# EAGLE design doughduino-v1 (EAGLE 5.11)
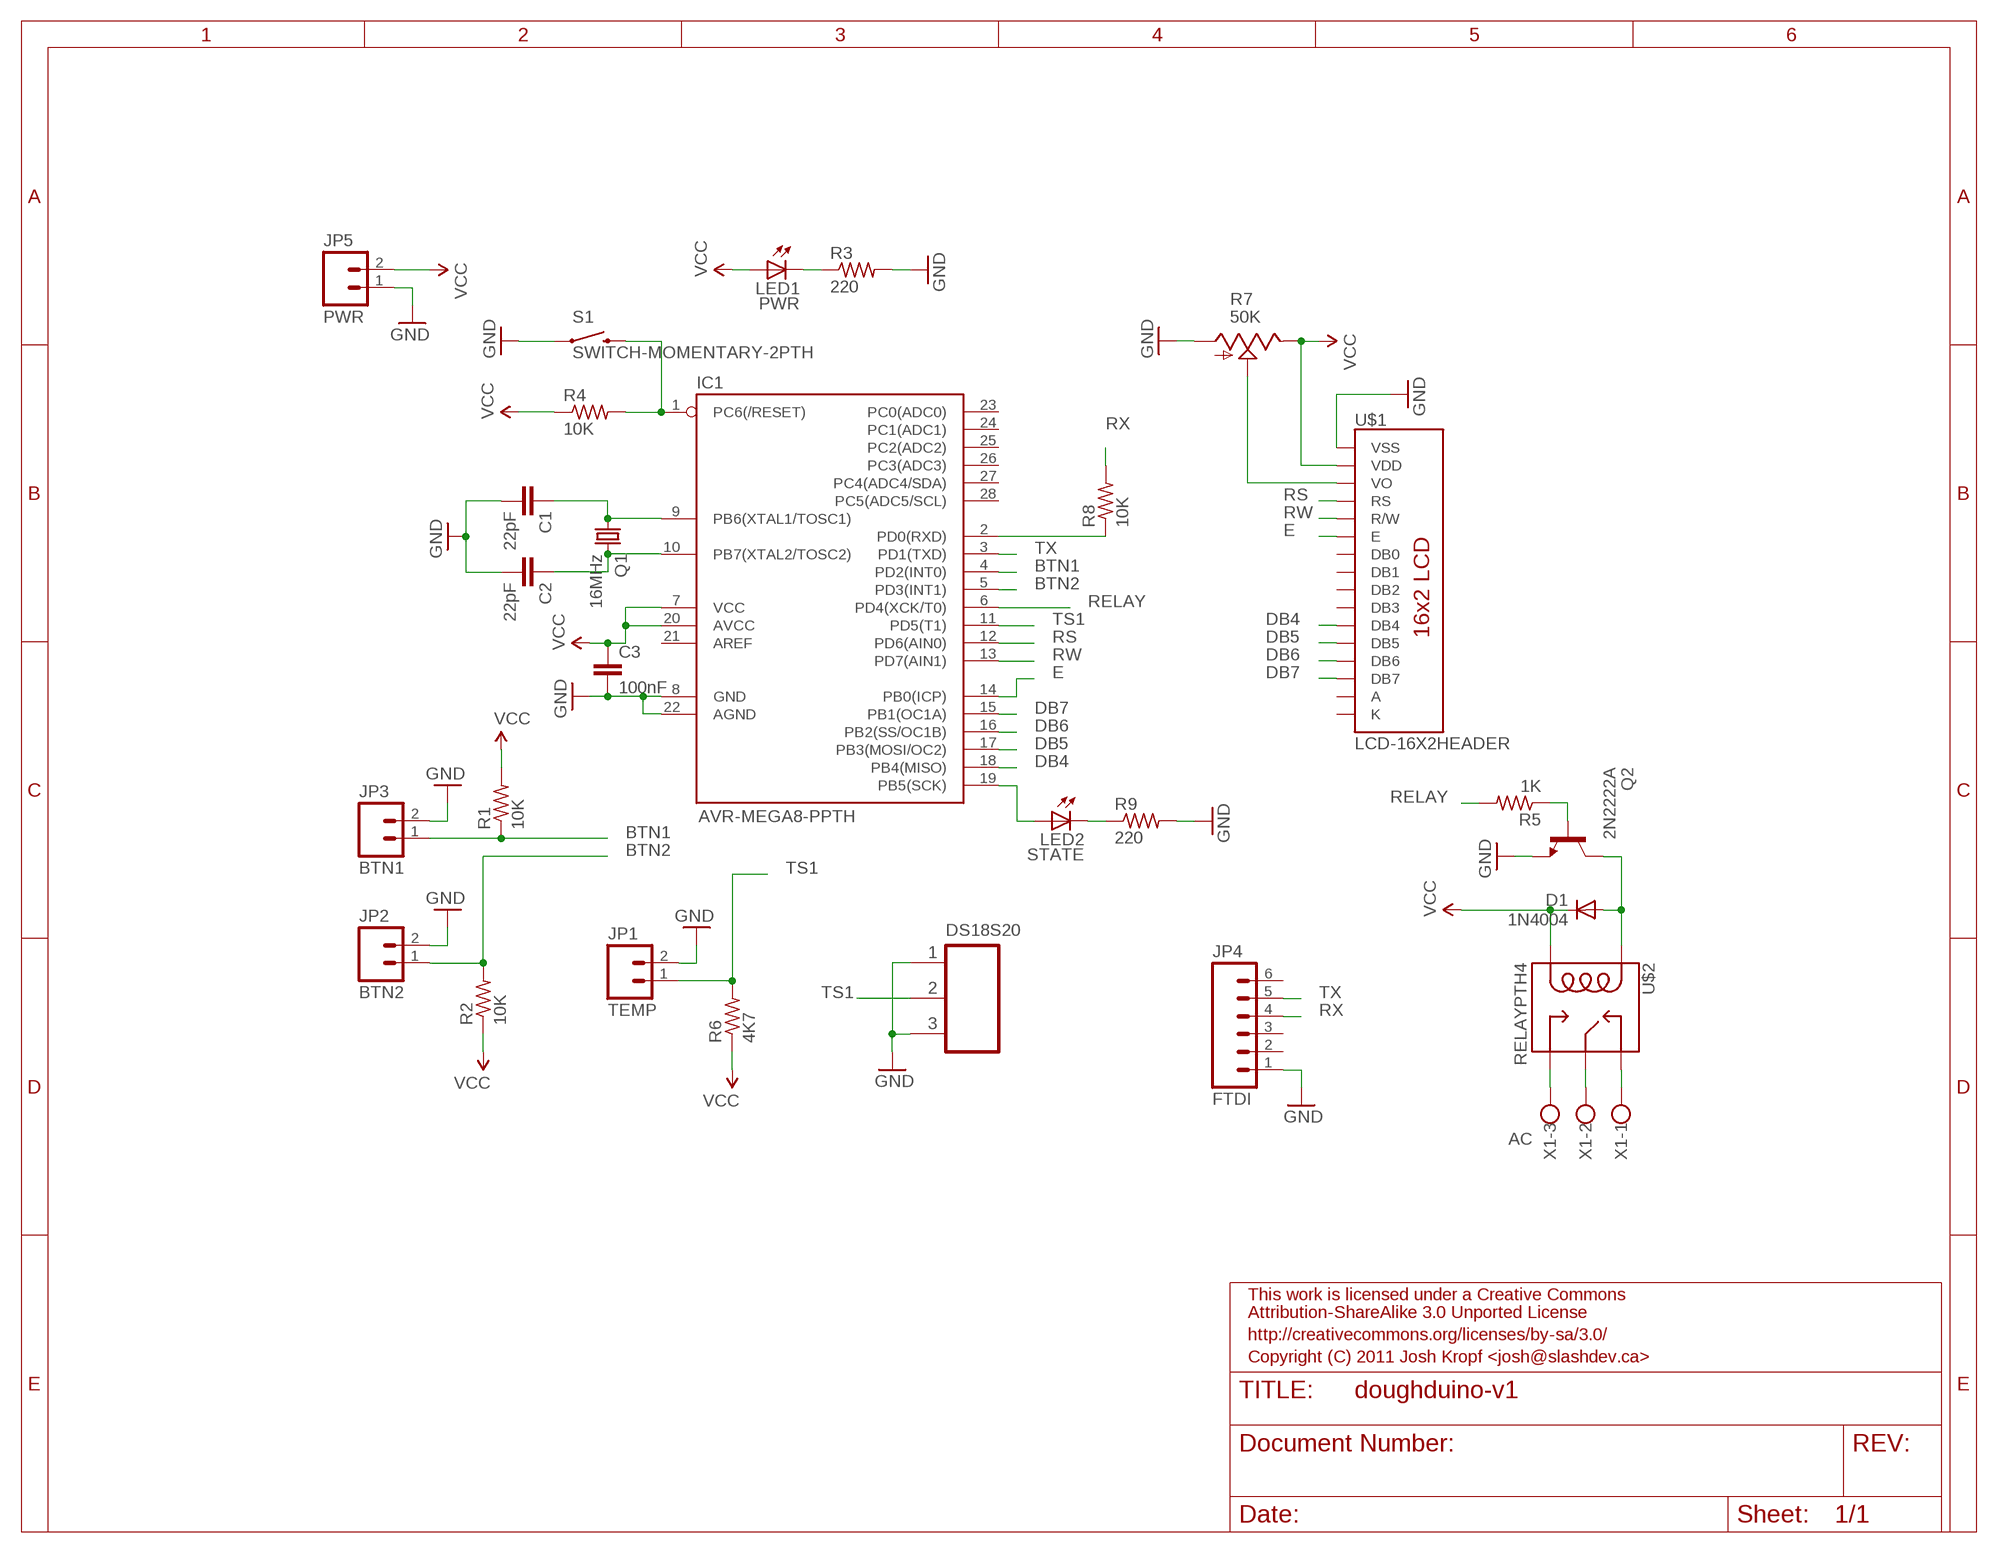
[diagram p0: schematic, sheet 1]

## Parts
C1  22pF  CAPPTH  [CAP-PTH-SMALL]
C2  22pF  CAPPTH  [CAP-PTH-SMALL]
C3  100nF  CAPPTH  [CAP-PTH-SMALL]
D1  1N4004  DIODEPTH  [DIODE-1N4001]
IC1  AVR-MEGA8-PPTH  [DIL28-3]
JP1  TEMP  M02PTH  [1X02]
JP2  BTN2  M02PTH  [1X02]
JP3  BTN1  M02PTH  [1X02]
JP4  FTDI  M06SIP  [1X06]
JP5  PWR  M02  [1X02_LONGPADS]
LED1  PWR  LED5MM  [LED5MM]
LED2  STATE  LED5MM  [LED5MM]
Q1  16MHz  CRYSTALHC49US  [HC49US]
Q2  2N2222A  [TO18]
R1  10K  R-US_0207/10  [0207/10]
R2  10K  R-US_0207/10  [0207/10]
R3  220  R-US_0207/10  [0207/10]
R4  10K  R-US_0207/10  [0207/10]
R5  1K  R-US_0207/10  [0207/10]
R6  4K7  R-US_0207/10  [0207/10]
R7  50K  TRIM_US-B25P  [B25P]
R8  10K  R-US_0207/10  [0207/10]
R9  220  R-US_0207/10  [0207/10]
S1  SWITCH-MOMENTARY-2PTH  [TACTILE-PTH]
U$1  LCD-16X2HEADER  [LCD-16X2-HEADER]
U$2  RELAYPTH4  [RELAY-JZC]
X1  AC  W237-103  [W237-103]

## Nets
BTN1: IC1.4(PD2(INT0)) JP3.1 R1.1
BTN2: IC1.5(PD3(INT1)) JP2.1 R2.2
DB4: IC1.18(PB4(MISO)) U$1.11(DB4)
DB5: IC1.17(PB3(MOSI/OC2)) U$1.12(DB5)
DB6: IC1.16(PB2(SS/OC1B)) U$1.13(DB6)
DB7: IC1.15(PB1(OC1A)) U$1.14(DB7)
E: IC1.14(PB0(ICP)) U$1.6(E)
GND: C1.2 C2.2 C3.2 IC1.8(GND) IC1.22(AGND) JP1.2 JP2.2 JP3.2 JP4.1 JP5.1 Q2.1(E) R3.2 R7.A R9.2 S1.1 U$1.1(VSS)
N$1: C1.1 IC1.9(PB6(XTAL1/TOSC1)) Q1.1
N$2: C2.1 IC1.10(PB7(XTAL2/TOSC2)) Q1.2
N$3: Q2.2(B) R5.1
N$4: U$2.3(NO) X1.3
N$5: LED2.K(C) R9.1
N$6: U$2.2(MAIN) X1.2
N$7: U$2.4(NC) X1.1
N$8: IC1.19(PB5(SCK)) LED2.A
N$14: D1.A Q2.3(C) U$2.5(COIL1)
N$15: IC1.1(PC6(/RESET)) R4.2 S1.3
N$16: LED1.K(C) R3.1
N$19: R7.S U$1.3(VO)
N$22: IC1.2(PD0(RXD)) R8.1
RELAY: IC1.6(PD4(XCK/T0)) R5.2
RS: IC1.12(PD6(AIN0)) U$1.4(RS)
RW: IC1.13(PD7(AIN1)) U$1.5(R/W)
RX: JP4.4 R8.2
TS1: IC1.11(PD5(T1)) JP1.1 R6.2
TX: IC1.3(PD1(TXD)) JP4.5
VCC: C3.1 D1.C IC1.7(VCC) IC1.20(AVCC) JP5.2 LED1.A R1.2 R2.1 R4.1 R6.1 R7.E U$1.2(VDD) U$2.1(COIL2)
Unconnected: IC1.21(AREF) IC1.23(PC0(ADC0)) IC1.24(PC1(ADC1)) IC1.25(PC2(ADC2)) IC1.26(PC3(ADC3)) IC1.27(PC4(ADC4/SDA)) IC1.28(PC5(ADC5/SCL)) JP4.2 JP4.3 JP4.6 U$1.7(DB0) U$1.8(DB1) U$1.9(DB2) U$1.10(DB3)

## Notes on the sheet
- DS18S20
- 1
- 2
- 3
- This work is licensed under a Creative Commons
- Attribution-ShareAlike 3.0 Unported License
- http://creativecommons.org/licenses/by-sa/3.0/
- Copyright (C) 2011 Josh Kropf <josh@slashdev.ca>

## Power pins joined to a net without a drawn wire
A: U$1.15(A)
K: U$1.16(K)

## Library data of the parts
C1-C3 = SparkFun:CAP: Capacitor Standard 0603 ceramic capacitor, and 0.1" leaded capacitor.
D1 = SparkFun:DIODE: Diode These are standard reverse protection diodes and small signal diodes. SMA package can handle up to about 1A. SOD-323 can handle about 200mA. What the SOD-323 package when ordering, there are some mfgs out there that are 5-pin packages.
IC1 = SparkFun:AVR-MEGA8-P: MICROCONTROLLER 8 Kbytes FLASH 1 kbytes SRAM 512 bytes EEPROM USART 4-channel 10 bit ADC 2-channel 8 bit ADC
JP1-JP3 JP5 = SparkFun:M02: Header 2 Standard 2-pin 0.1" header. Use with straight break away headers (SKU : PRT-00116), right angle break away headers (PRT-00553), swiss pins (PRT-00743), machine pins (PRT-00117), and female headers (PRT-00115). Molex polarized connector foot print use with SKU : PRT-08233 with associated crimp pins and housings.
JP4 = SparkFun:M06: Header 6 Standard 6-pin 0.1" header. Use with straight break away headers (SKU : PRT-00116), right angle break away headers (PRT-00553), swiss pins (PRT-00743), machine pins (PRT-00117), and female headers (PRT-00115). Molex polarized connector foot print use with SKU : PRT-08094 with associated crimp pins and housings. NOTES ON THE VARIANTS LOCK and LOCK_LONGPADS... This footprint was designed to help hold the alignment of a through-hole component (i.e. 6-pin header) while soldering it into place. You may notice that each hole has been shifted either up or down by 0.005 of an inch from it's more standard position (which is a perfectly straight line). This slight alteration caused the pins (the squares in the middle) to touch the edges of the holes. Because they are alternating, it causes a "brace" to hold the component in place. 0.005 has proven to be the perfect amount of "off-center" position when using our standard breakaway headers. Although looks a little odd when you look at the bare footprint, once you have a header in there, the alteration is very hard to notice. Also, if you push a header all the way into place, it is covered up entirely on the bottom side. This idea of altering the position of holes to aid alignment will be further integrated into the Sparkfun Library for other footprints. It can help hold any component with 3 or more connection pins.
LED1 LED2 = SparkFun:LED: LEDs Standard schematic elements and footprints for 5mm, 3mm, 1206, and 0603 sized LEDs. 5mm - Spark Fun Electronics SKU : COM-00529 (and others)
Q1 = SparkFun:CRYSTAL: Crystals Various standard crystals. Proven footprints. Spark Fun Electronics SKU : COM-00534
Q2 = transistor-npn:2N2222*: NPN Transistor
R1-R6 R8 R9 = resistor:R-US_: RESISTOR, American symbol
R7 = pot:TRIM_US-: POTENTIOMETER
S1 = SparkFun:SWITCH-MOMENTARY-2
U$1 = SparkFun:LCD-16X2
U$2 = SparkFun:RELAY
X1 = con-wago-500:W237-103: WAGO SCREW CLAMP

## Board
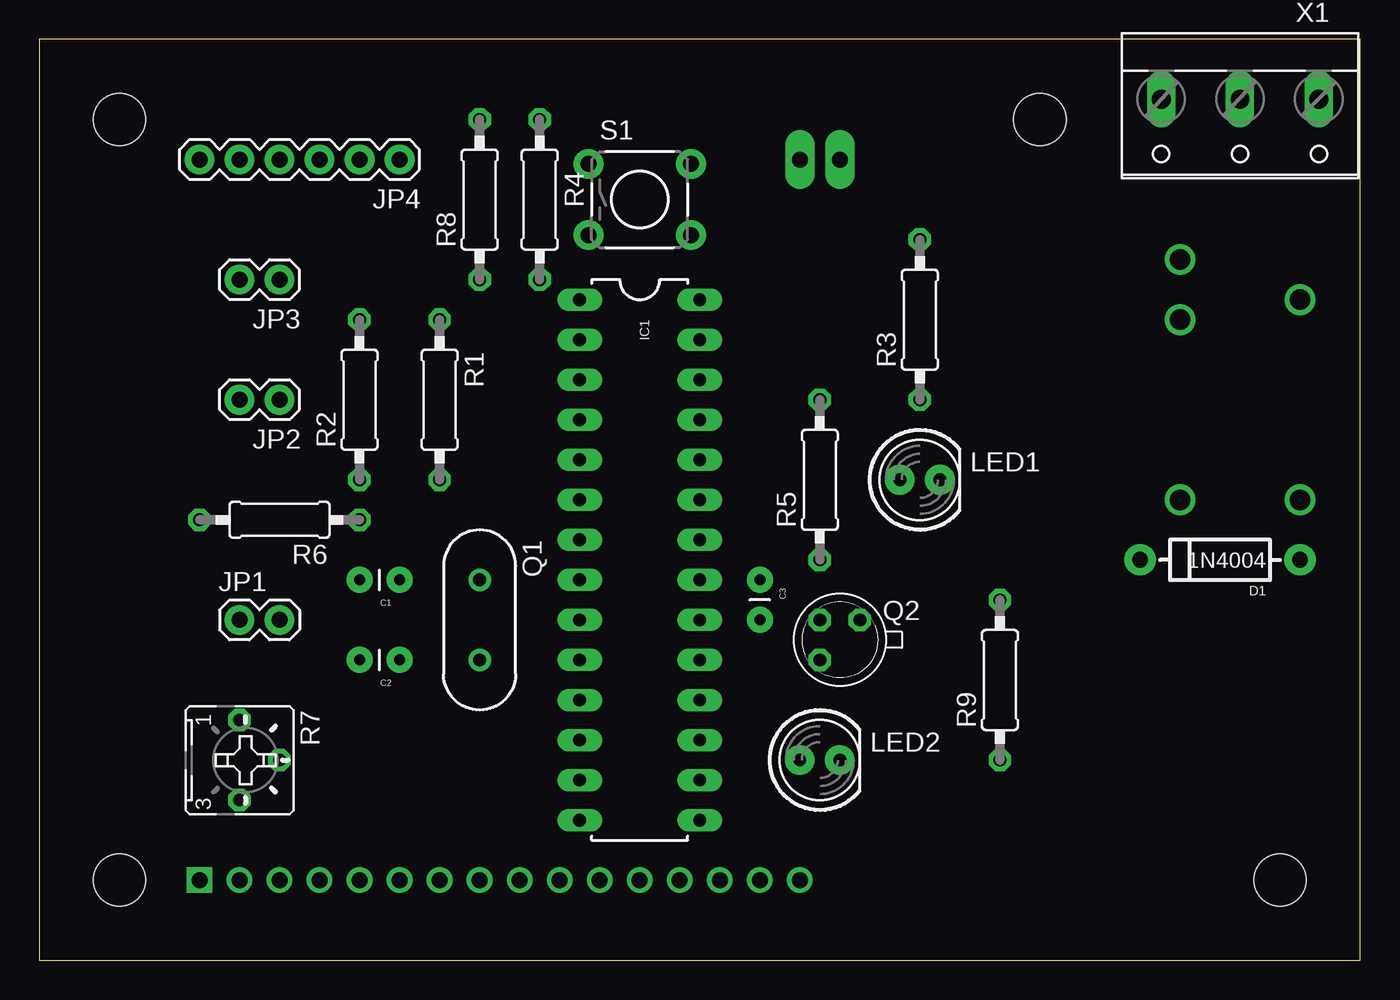
[diagram p1: board, top side]
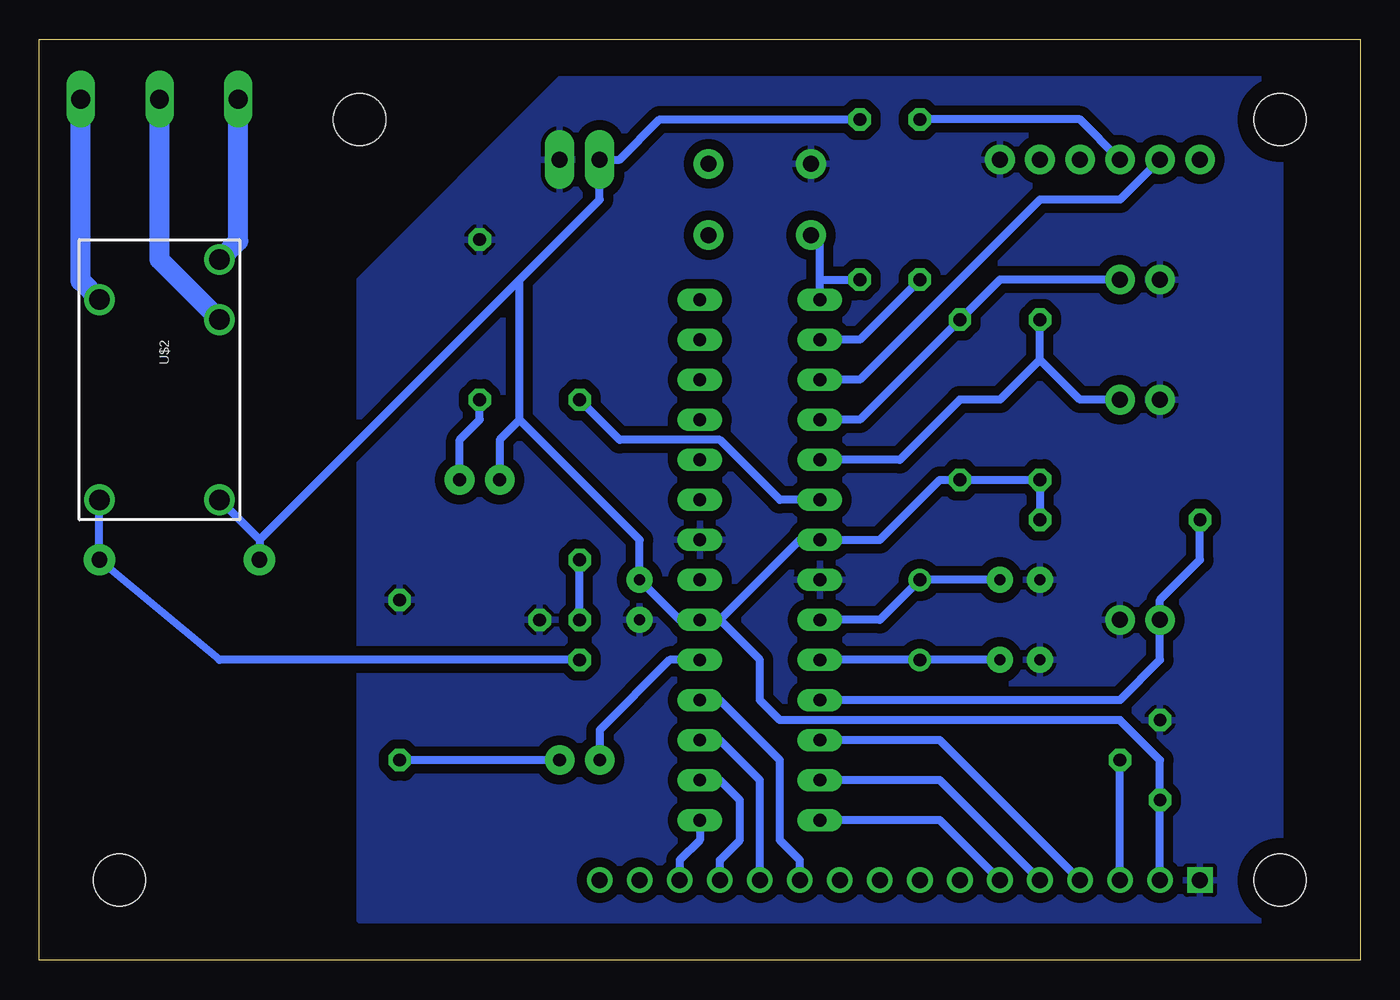
[diagram p2: board, bottom side, seen from below]

Size 83.82 x 58.42 mm. Coordinates in mm from the lower left corner, seen from the top.
Outline: 0,0 83.82,0 83.82,58.42 0,58.42 0,0
Copper layers (1*16): Top 0.035mm / dielectric 1.5mm / Bottom 0.035mm
Design rules "homebrew": minimum track width 20mil, minimum drill 24mil, track to track 8mil, track to pad 8mil, pad to pad 8mil, via to via 8mil, smd to smd 8mil, copper to edge 40mil, drill to drill 8mil, minimum pad ring 12mil, minimum via ring 8mil, stop-mask expansion 4mil, vias tented up to drill 0mil, thermal gap 10mil

### Footprints (pad centres in the part's own frame; a part is rotated, then mirrored left to right if it is on the bottom)
CAP-PTH-SMALL = drill 0.7 pad 1.651 round: 1 0,0; 2 2.54,0
DIODE-1N4001 = drill 1 pad 1.981 round: A -5.08,0; C 5.08,0
DIL28-3 = drill 0.813 long: 1 -16.51,-3.81; 2 -13.97,-3.81; 3 -11.43,-3.81; 4 -8.89,-3.81; 5 -6.35,-3.81; 6 -3.81,-3.81; 7 -1.27,-3.81; 8 1.27,-3.81; 9 3.81,-3.81; 10 6.35,-3.81; 11 8.89,-3.81; 12 11.43,-3.81; 13 13.97,-3.81; 14 16.51,-3.81; 15 16.51,3.81; 16 13.97,3.81; 17 11.43,3.81; 18 8.89,3.81; 19 6.35,3.81; 20 3.81,3.81; 21 1.27,3.81; 22 -1.27,3.81; 23 -3.81,3.81; 24 -6.35,3.81; 25 -8.89,3.81; 26 -11.43,3.81; 27 -13.97,3.81; 28 -16.51,3.81
1X02 = drill 1.016 pad 1.88 round: 1 0,0; 2 2.54,0
1X06 = drill 1.016 pad 1.88 round: 1 0,0; 2 2.54,0; 3 5.08,0; 4 7.62,0; 5 10.16,0; 6 12.7,0
1X02_LONGPADS = drill 1.016 pad 1.88 long: 1 0,0; 2 2.54,0
LED5MM = drill 0.813 pad 1.88 round: A -1.27,0; K 1.27,0
HC49US = drill 0.813 round: 1 -2.54,0; 2 2.54,0
TO18 = drill 0.813 octagon: 1 -1.27,-1.27; 2 1.27,-1.27; 3 1.27,1.27
0207/10 = drill 0.813 octagon: 1 -5.08,0; 2 5.08,0
B25P = drill 0.813 octagon: A -2.54,0; E 2.54,0; S 0,2.54
TACTILE-PTH = drill 1.016 pad 1.88 round: 1 -3.251,2.261; 2 3.251,2.261; 3 -3.251,-2.261; 4 3.251,-2.261
LCD-16X2-HEADER = drill 1.016 square: 1 0,0 | drill 1.016 round: 2 2.54,0; 3 5.08,0; 4 7.62,0; 5 10.16,0; 6 12.7,0; 7 15.24,0; 8 17.78,0; 9 20.32,0; 10 22.86,0; 11 25.4,0; 12 27.94,0; 13 30.48,0; 14 33.02,0; 15 35.56,0; 16 38.1,0
RELAY-JZC = drill 1.3 round: 1 8.89,3.81; 2 -2.54,3.81; 3 -6.35,3.81; 4 -3.81,-3.81; 5 8.89,-3.81
STAND-OFF = hole 3.302: 0,0
W237-103 = drill 1.194 long: 1 -5,-1.29; 2 0,-1.29; 3 5,-1.29

### Placement (x,y rotation side)
C1  22.86,24.13 180 top
C2  22.86,19.05 180 top
C3  45.72,24.13 270 top
D1  74.93,25.4 180 top
IC1  38.1,25.4 270 top
JP1  12.7,21.59 0 top
JP2  15.24,35.56 180 top
JP3  15.24,43.18 180 top
JP4  22.86,50.8 180 top
JP5  50.8,50.8 180 top
LED1  55.88,30.48 0 top
LED2  49.53,12.7 0 top
Q1  27.94,21.59 270 top
Q2  50.8,20.32 180 top
R1  25.4,35.56 270 top
R2  20.32,35.56 90 top
R3  55.88,40.64 90 top
R4  31.75,48.26 270 top
R5  49.53,30.48 90 top
R6  15.24,27.94 180 top
R7  12.7,12.7 270 top
R8  27.94,48.26 90 top
R9  60.96,17.78 90 top
S1  38.1,48.26 0 top
U$1  10.16,5.08 0 top
U$2  76.2,38.1 270 bottom
U$3  [STAND-OFF]  78.74,5.08 0 top
U$4  [STAND-OFF]  63.5,53.34 0 top
U$5  [STAND-OFF]  5.08,53.34 0 top
U$6  [STAND-OFF]  5.08,5.08 0 top
X1  76.2,53.34 180 top

### Tracks (layer width: path | path; a pad name or v marks a point on that pad's centre or on a via)
BTN1
  Bottom 0.508: IC1.4 31.75,34.29 R1.1 22.86,43.18 JP3.1
BTN2
  Bottom 0.508: IC1.5 29.21,31.75 25.4,35.56 22.86,35.56 20.32,38.1 | JP2.1 17.78,35.56 20.32,38.1 | 20.32,38.1 R2.2
DB4
  Bottom 0.508: IC1.18 40.64,16.51 36.83,12.7 36.83,7.62 35.56,6.35 U$1.11
DB5
  Bottom 0.508: IC1.17 40.64,13.97 38.1,11.43 U$1.12
DB6
  Bottom 0.508: IC1.16 40.64,11.43 39.37,10.16 39.37,7.62 40.64,6.35 U$1.13
DB7
  Bottom 0.508: IC1.15 41.91,7.62 43.18,6.35 U$1.14
E
  Bottom 0.508: IC1.14 26.67,8.89 U$1.6
GND
  pour Bottom (isolate 0.61): 5.08,2.54 5.08,55.88 50.8,55.88 63.5,43.18 63.5,2.54
N$1
  Bottom 0.508: C1.1 Q1.1 30.48,21.59 IC1.9
N$2
  Bottom 0.508: IC1.10 Q1.2 C2.1
N$3
  Bottom 0.508: Q2.2 R5.1
N$4
  Bottom 1.27: X1.3 71.2,45.64 U$2.3
N$5
  Bottom 0.508: LED2.K R9.1
N$6
  Bottom 1.27: X1.2 76.2,44.45 U$2.2
N$7
  Bottom 1.27: X1.1 81.2,43.1 U$2.4
N$8
  Bottom 0.508: IC1.19 43.81,19.05 48.26,14.61 LED2.A
N$14
  Bottom 0.508: Q2.3 72.39,19.05 D1.A U$2.5
N$15
  Bottom 0.508: 34.29,43.18 34.29,45.72 S1.3 | IC1.1 34.29,43.18 | 34.29,43.18 R4.2
N$16
  Bottom 0.508: R3.1 55.88,34.29 57.15,33.02 LED1.K
N$19
  Bottom 0.508: U$1.3 R7.S
N$22
  Bottom 0.508: R8.1 31.75,39.37 IC1.2
RELAY
  Bottom 0.508: IC1.6 36.83,29.21 40.64,33.02 46.99,33.02 R5.2
RS
  Bottom 0.508: IC1.12 26.67,13.97 U$1.4
RW
  Bottom 0.508: IC1.13 26.67,11.43 U$1.5
RX
  Bottom 0.508: R8.2 17.78,53.34 JP4.4
TS1
  Bottom 0.508: IC1.11 15.24,16.51 12.7,19.05 JP1.1 12.7,22.86 10.16,25.4 R6.2
TX
  Bottom 0.508: IC1.3 31.75,36.83 20.32,48.26 15.24,48.26 JP4.5
VCC
  Bottom 0.508: 40.64,21.59 35.56,26.67 IC1.7 30.48,26.67 26.67,30.48 R1.2 R2.1 R6.1 | 40.64,21.59 IC1.20 43.18,21.59 C3.1 45.72,26.67 53.34,34.29 | R4.1 44.45,53.34 46.99,50.8 JP5.2 48.26,48.26 53.34,43.18 | U$1.2 R7.E 12.7,12.7 15.24,15.24 36.83,15.24 38.1,16.51 38.1,19.05 40.64,21.59 | 53.34,34.29 53.34,43.18 | 53.34,34.29 54.61,33.02 LED1.A | 53.34,43.18 69.85,26.67 | 69.85,26.67 D1.C | 69.85,26.67 U$2.1

### Text on the board
tDocu: +5V | GND | NO | OUT | NC | RELAY